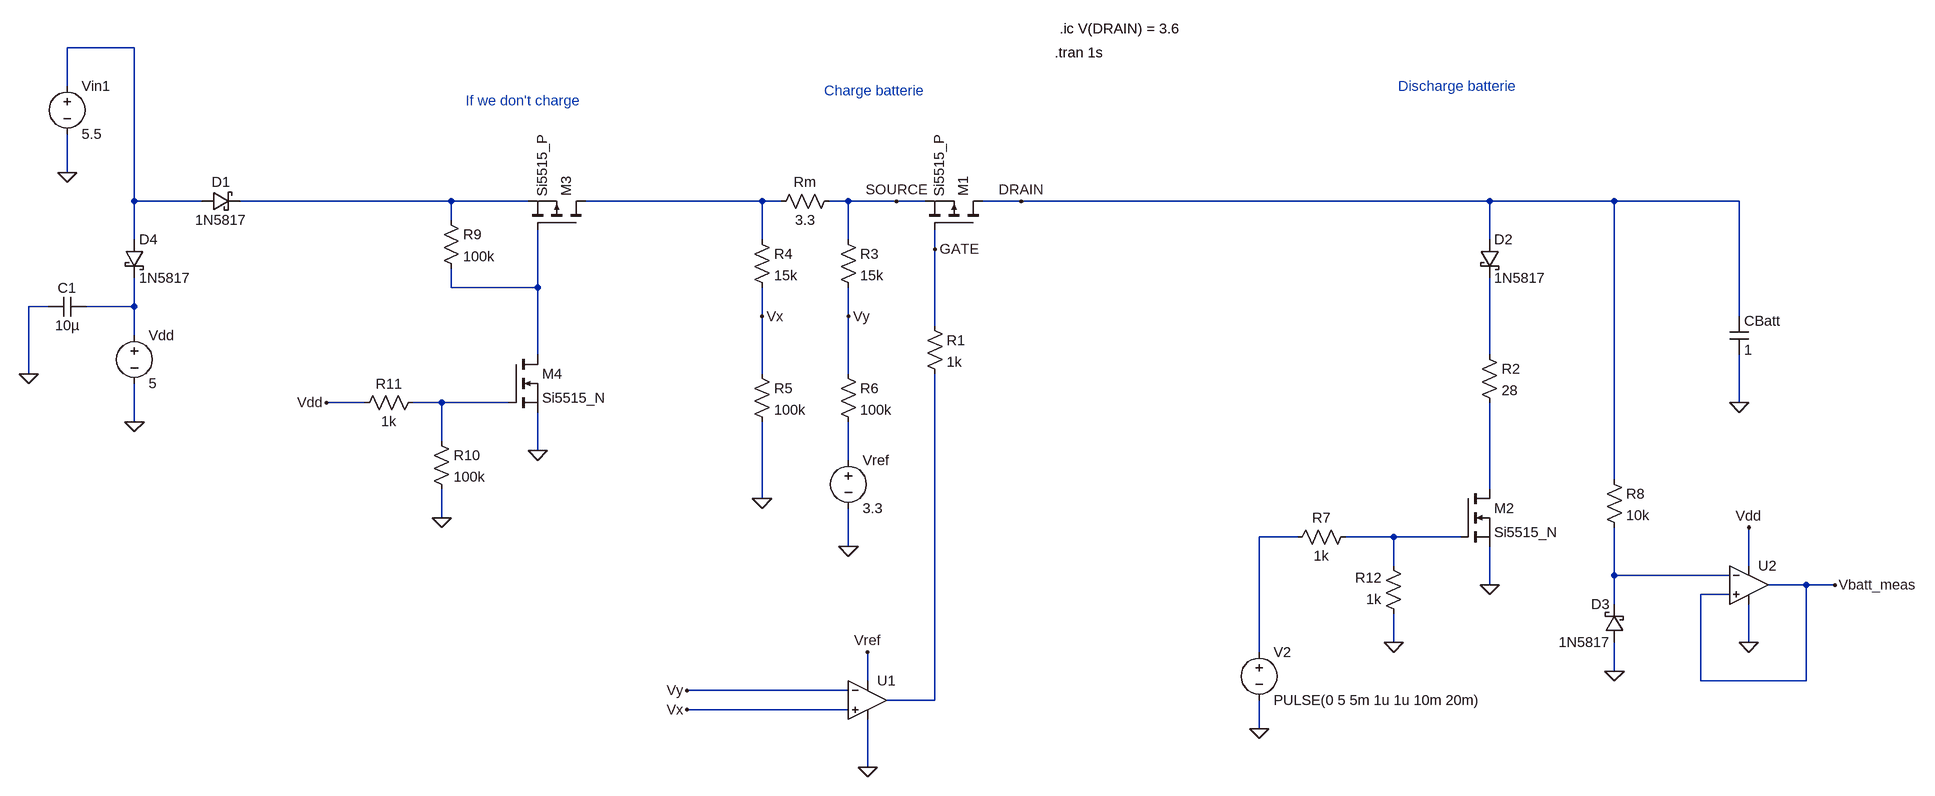
[diagram p0: schematic current_source.asc]
current_source.asc, the LTspice schematic file:
Version 4.1
SHEET 1 2588 1328
WIRE -736 -176 -848 -176
WIRE -848 -112 -848 -176
WIRE -848 32 -848 -32
WIRE -736 80 -736 -176
WIRE -624 80 -736 80
WIRE -208 80 -560 80
WIRE -80 80 -208 80
WIRE 640 80 16 80
WIRE 672 80 640 80
WIRE 784 80 752 80
WIRE 864 80 784 80
WIRE 912 80 864 80
WIRE 1072 80 1008 80
WIRE 1856 80 1072 80
WIRE 2064 80 1856 80
WIRE 2272 80 2064 80
WIRE -208 112 -208 80
WIRE -736 144 -736 80
WIRE 640 144 640 80
WIRE 784 144 784 80
WIRE 1856 144 1856 80
WIRE 928 160 928 128
WIRE -208 224 -208 192
WIRE -64 224 -64 128
WIRE -64 224 -208 224
WIRE -880 256 -912 256
WIRE -736 256 -736 208
WIRE -736 256 -816 256
WIRE 640 272 640 224
WIRE 784 272 784 224
WIRE 2272 272 2272 80
WIRE 928 288 928 160
WIRE -736 304 -736 256
WIRE -64 336 -64 224
WIRE 1856 336 1856 208
WIRE -912 368 -912 256
WIRE 640 368 640 272
WIRE 784 368 784 272
WIRE -352 416 -416 416
WIRE -224 416 -272 416
WIRE -112 416 -224 416
WIRE 2272 416 2272 336
WIRE -736 448 -736 384
WIRE -224 480 -224 416
WIRE -64 496 -64 432
WIRE 784 512 784 448
WIRE 2064 544 2064 80
WIRE 1856 560 1856 416
WIRE 640 576 640 448
WIRE -224 608 -224 560
WIRE 1536 640 1472 640
WIRE 1696 640 1616 640
WIRE 1808 640 1696 640
WIRE 784 656 784 592
WIRE 1696 688 1696 640
WIRE 2288 688 2288 624
WIRE 2064 704 2064 624
WIRE 2256 704 2064 704
WIRE 1856 720 1856 656
WIRE 2384 720 2320 720
WIRE 2432 720 2384 720
WIRE 2256 736 2208 736
WIRE 2064 752 2064 704
WIRE 1696 816 1696 768
WIRE 2288 816 2288 752
WIRE 1472 832 1472 640
WIRE 2064 864 2064 816
WIRE 816 880 816 832
WIRE 2208 880 2208 736
WIRE 2384 880 2384 720
WIRE 2384 880 2208 880
WIRE 784 896 448 896
WIRE 928 912 928 368
WIRE 928 912 848 912
WIRE 784 928 448 928
WIRE 1472 960 1472 912
WIRE 816 1024 816 944
FLAG 2272 416 0
FLAG 1856 720 0
FLAG -736 448 0
FLAG 1472 960 0
FLAG 640 272 Vx
FLAG 784 272 Vy
FLAG 448 928 Vx
FLAG 448 896 Vy
FLAG 640 576 0
FLAG 784 656 0
FLAG 928 160 GATE
FLAG 864 80 SOURCE
FLAG 1072 80 DRAIN
FLAG 2064 864 0
FLAG 816 832 Vref
FLAG 2288 624 Vdd
FLAG 2288 816 0
FLAG 2432 720 Vbatt_meas
FLAG 816 1024 0
FLAG -848 32 0
FLAG -912 368 0
FLAG -64 496 0
FLAG -224 608 0
FLAG -416 416 Vdd
FLAG 1696 816 0
SYMBOL res 656 96 R270
WINDOW 0 32 56 VTop 2
WINDOW 3 0 56 VBottom 2
SYMATTR InstName Rm
SYMATTR Value 3.3
SYMBOL pmos 1008 128 M270
SYMATTR InstName M1
SYMATTR Value Si5515_P
SYMBOL nmos 1808 560 R0
SYMATTR InstName M2
SYMATTR Value Si5515_N
SYMBOL res 912 272 R0
SYMATTR InstName R1
SYMATTR Value 1k
SYMBOL res 1840 320 R0
SYMATTR InstName R2
SYMATTR Value 28
SYMBOL schottky -624 96 R270
WINDOW 0 32 32 VTop 2
WINDOW 3 0 32 VBottom 2
SYMATTR InstName D1
SYMATTR Value 1N5817
SYMBOL voltage -736 288 R0
WINDOW 123 0 0 Left 0
WINDOW 39 0 0 Left 0
SYMATTR InstName Vdd
SYMATTR Value 5
SYMBOL voltage 1472 816 R0
WINDOW 123 0 0 Left 0
WINDOW 39 0 0 Left 0
SYMATTR InstName V2
SYMATTR Value PULSE(0 5 5m 1u 1u 10m 20m)
SYMBOL OpAmps\\UniversalOpAmp2 816 912 R0
SYMATTR InstName U1
SYMBOL cap 2256 272 R0
SYMATTR InstName CBatt
SYMATTR Value 1
SYMBOL res 768 128 R0
SYMATTR InstName R3
SYMATTR Value 15k
SYMBOL res 624 128 R0
SYMATTR InstName R4
SYMATTR Value 15k
SYMBOL res 624 352 R0
SYMATTR InstName R5
SYMATTR Value 100k
SYMBOL res 768 352 R0
SYMATTR InstName R6
SYMATTR Value 100k
SYMBOL voltage 784 496 R0
SYMATTR InstName Vref
SYMATTR Value 3.3
SYMBOL schottky 1840 144 R0
SYMATTR InstName D2
SYMATTR Value 1N5817
SYMBOL res 1632 624 R90
WINDOW 0 0 56 VBottom 2
WINDOW 3 32 56 VTop 2
SYMATTR InstName R7
SYMATTR Value 1k
SYMBOL schottky 2080 816 R180
WINDOW 0 24 64 Left 2
WINDOW 3 24 0 Left 2
SYMATTR InstName D3
SYMATTR Value 1N5817
SYMBOL res 2048 528 R0
SYMATTR InstName R8
SYMATTR Value 10k
SYMBOL OpAmps\\UniversalOpAmp2 2288 720 R0
SYMATTR InstName U2
SYMBOL schottky -752 144 R0
SYMATTR InstName D4
SYMATTR Value 1N5817
SYMBOL voltage -848 -128 R0
SYMATTR InstName Vin1
SYMATTR Value 5.5
SYMBOL cap -816 240 R90
WINDOW 0 0 32 VBottom 2
WINDOW 3 32 32 VTop 2
SYMATTR InstName C1
SYMATTR Value 10µ
SYMBOL pmos 16 128 M270
SYMATTR InstName M3
SYMATTR Value Si5515_P
SYMBOL nmos -112 336 R0
SYMATTR InstName M4
SYMATTR Value Si5515_N
SYMBOL res -224 96 R0
SYMATTR InstName R9
SYMATTR Value 100k
SYMBOL res -240 464 R0
SYMATTR InstName R10
SYMATTR Value 100k
SYMBOL res -256 400 R90
WINDOW 0 0 56 VBottom 2
WINDOW 3 32 56 VTop 2
SYMATTR InstName R11
SYMATTR Value 1k
SYMBOL res 1712 784 R180
WINDOW 0 36 76 Left 2
WINDOW 3 36 40 Left 2
SYMATTR InstName R12
SYMATTR Value 1k
TEXT 1128 -168 Left 2 !.tran 1s
TEXT 1136 -208 Left 2 !.ic V(DRAIN) = 3.6
TEXT 744 -104 Left 2 ;Charge batterie
TEXT -184 -88 Left 2 ;If we don't charge
TEXT 1704 -112 Left 2 ;Discharge batterie

The netlist it stands for:
* current_source.asc
Rm N003 SOURCE 3.3
M1 DRAIN GATE SOURCE SOURCE Si5515_P
M2 N009 N011 0 0 Si5515_N
R1 GATE N013 1k
R2 N006 N009 28
D1 N001 N002 1N5817
Vdd N005 0 5
V2 N010 0 PULSE(0 5 5m 1u 1u 10m 20m)
X§U1 Vx Vy Vref 0 N013 level2 Avol=1Meg GBW=10Meg Slew=10Meg Ilimit=25m Rail=0 Vos=0 En=0 Enk=0 In=0 Ink=0 Rin=500Meg  ; pins In+ In- V+ V- OUT
CBatt DRAIN 0 1
R3 SOURCE Vy 15k
R4 N003 Vx 15k
R5 Vx 0 100k
R6 Vy N008 100k
Vref N008 0 3.3
D2 DRAIN N006 1N5817
R7 N011 N010 1k
D3 0 N012 1N5817
R8 DRAIN N012 10k
X§U2 Vbatt_meas N012 Vdd 0 Vbatt_meas level2 Avol=1Meg GBW=10Meg Slew=10Meg Ilimit=25m Rail=0 Vos=0 En=0 Enk=0 In=0 Ink=0 Rin=500Meg  ; pins In+ In- V+ V- OUT
D4 N001 N005 1N5817
Vin1 N001 0 5.5
C1 N005 0 10µ
M3 N003 N004 N002 N002 Si5515_P
M4 N004 N007 0 0 Si5515_N
R9 N002 N004 100k
R10 N007 0 100k
R11 N007 Vdd 1k
R12 0 N011 1k
.model D D
.lib standard.dio
.model NMOS NMOS
.model PMOS PMOS
.lib standard.mos
.tran 1s
.ic V(DRAIN) = 3.6
* Charge batterie
* If we don't charge
* Discharge batterie
.lib UniversalOpAmp2.lib
.backanno
.end